# Altium schematic sheet memory.SchDoc
size A4
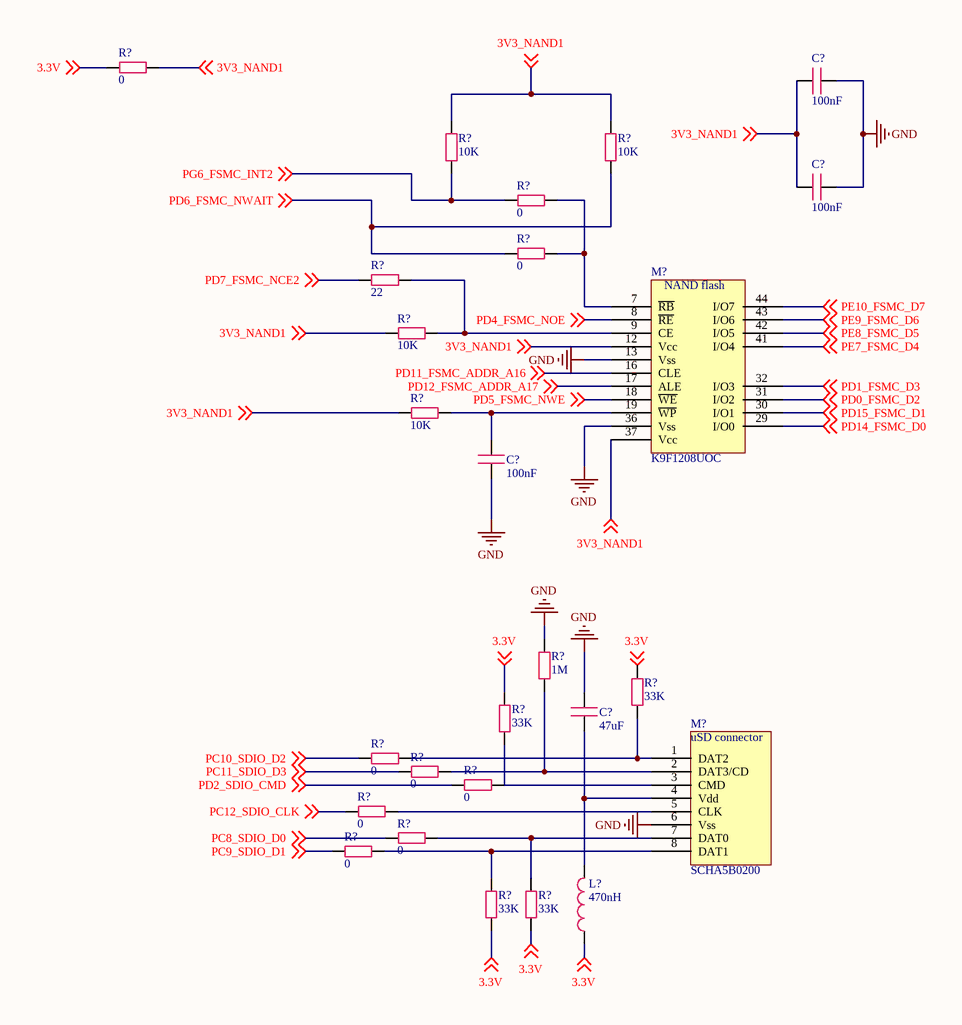
[diagram p0: memory.SchDoc]

## Parts
(Parts that share a designator on the sheet are numbered #1, #2 ... from top to bottom, then left to right.)
C?#1  value 100nF  [C0402]  (hidden comment: Capacity)
C?#2  value 100nF  [C0402]  (hidden comment: Capacity)
C?#3  value 100nF  [C0402]  (hidden comment: Capacity)
C?#4  value 47uF  [C0402]  (hidden comment: Capacity)
L?  value 470nH  [L0402]  (hidden comment: Inductor)
M?#1  K9F1208UOC  [TSSOP50P2000X120-48N]
M?#2  SCHA5B0200
R?#1  value 0  [R0402]  (hidden comment: Resistor)
R?#2  value 10K  [R0402]  (hidden comment: Resistor)
R?#3  value 10K  [R0402]  (hidden comment: Resistor)
R?#4  value 0  [R0402]  (hidden comment: Resistor)
R?#5  value 0  [R0402]  (hidden comment: Resistor)
R?#6  value 22  [R0402]  (hidden comment: Resistor)
R?#7  value 10K  [R0402]  (hidden comment: Resistor)
R?#8  value 10K  [R0402]  (hidden comment: Resistor)
R?#9  value 1M  [R0402]  (hidden comment: Resistor)
R?#10  value 33K  [R0402]  (hidden comment: Resistor)
R?#11  value 33K  [R0402]  (hidden comment: Resistor)
R?#12  value 0  [R0402]  (hidden comment: Resistor)
R?#13  value 0  [R0402]  (hidden comment: Resistor)
R?#14  value 0  [R0402]  (hidden comment: Resistor)
R?#15  value 0  [R0402]  (hidden comment: Resistor)
R?#16  value 0  [R0402]  (hidden comment: Resistor)
R?#17  value 0  [R0402]  (hidden comment: Resistor)
R?#18  value 33K  [R0402]  (hidden comment: Resistor)
R?#19  value 33K  [R0402]  (hidden comment: Resistor)

## Nets
GND: C?#1.2 C?#2.2 C?#3.2 C?#4.1 M?#1.13(Vss) M?#1.36(Vss) M?#2.6(Vss) R?#9.2
3.3V: L?.1 R?#1.2 R?#10.2 R?#11.2 R?#18.1 R?#19.1 ; off-sheet 3.3V
3V3_NAND1: C?#1.1 C?#2.1 M?#1.12(Vcc) M?#1.37(Vcc) R?#1.1 R?#2.1 R?#3.1 R?#7.2 R?#8.2 ; off-sheet 3V3_NAND1
PC8_SDIO_D0: R?#16.2 ; off-sheet PC8_SDIO_D0
PC9_SDIO_D1: R?#17.2 ; off-sheet PC9_SDIO_D1
PC10_SDIO_D2: R?#12.2 ; off-sheet PC10_SDIO_D2
PC11_SDIO_D3: R?#13.2 ; off-sheet PC11_SDIO_D3
PC12_SDIO_CLK: R?#15.2 ; off-sheet PC12_SDIO_CLK
PD0_FSMC_D2: M?#1.31(I/O2) ; off-sheet PD0_FSMC_D2
PD1_FSMC_D3: M?#1.32(I/O3) ; off-sheet PD1_FSMC_D3
PD2_SDIO_CMD: R?#14.2 ; off-sheet PD2_SDIO_CMD
PD4_FSMC_NOE: M?#1.8(~{RE}) ; off-sheet PD4_FSMC_NOE
PD5_FSMC_NWE: M?#1.18(~{WE}) ; off-sheet PD5_FSMC_NWE
PD6_FSMC_NWAIT: R?#3.2 R?#5.2 ; off-sheet PD6_FSMC_NWAIT
PD7_FSMC_NCE2: R?#6.2 ; off-sheet PD7_FSMC_NCE2
PD11_FSMC_ADDR_A16: M?#1.16(CLE) ; off-sheet PD11_FSMC_ADDR_A16
PD12_FSMC_ADDR_A17: M?#1.17(ALE) ; off-sheet PD12_FSMC_ADDR_A17
PD14_FSMC_D0: M?#1.29(I/O0) ; off-sheet PD14_FSMC_D0
PD15_FSMC_D1: M?#1.30(I/O1) ; off-sheet PD15_FSMC_D1
PE7_FSMC_D4: M?#1.41(I/O4) ; off-sheet PE7_FSMC_D4
PE8_FSMC_D5: M?#1.42(I/O5) ; off-sheet PE8_FSMC_D5
PE9_FSMC_D6: M?#1.43(I/O6) ; off-sheet PE9_FSMC_D6
PE10_FSMC_D7: M?#1.44(I/O7) ; off-sheet PE10_FSMC_D7
PG6_FSMC_INT2: R?#2.2 R?#4.2 ; off-sheet PG6_FSMC_INT2
NetC?#3_1: C?#3.1 M?#1.19(~{WP}) R?#8.1
NetC?#4_2: C?#4.2 L?.2 M?#2.4(Vdd)
NetM?#1_7: M?#1.7(~{RB}) R?#4.1 R?#5.1
NetM?#1_9: M?#1.9(CE) R?#6.1 R?#7.1
NetM?#2_1: M?#2.1(DAT2) R?#10.1 R?#12.1
NetM?#2_2: M?#2.2(DAT3/CD) R?#9.1 R?#13.1
NetM?#2_3: M?#2.3(CMD) R?#11.1 R?#14.1
NetM?#2_5: M?#2.5(CLK) R?#15.1
NetM?#2_7: M?#2.7(DAT0) R?#16.1 R?#19.2
NetM?#2_8: M?#2.8(DAT1) R?#17.1 R?#18.2

Not connected (* = marked no-connect by the designer): M?#1 1(NC) 2(NC) 3(NC) 4(NC) 5(NC) 6(NC) 10(NC) 11(NC) 14(NC) 15(NC) 20(NC) 21(NC) 22(NC) 23(NC) 24(NC) 25(NC) 26(NC) 27(NC) 28(NC) 33(NC) 34(NC) 35(NC) 38(NC) 39(NC) 40(NC) 45(NC) 46(NC) 47(NC) 48(NC)

## Notes on the sheet
- (in symbol K9F1208UOC) NAND flash
- (in symbol SCHA5B0200) uSD connector

## Library data of the parts
M?#1 = K9F1208UOC: 64x8 NAND flash; Volume: 64MB
M?#2 = SCHA5B0200: MicroSD connector